# Altium schematic sheet M2_WIFI.SchDoc
size C; SheetNumber: 13; SheetTotal: 19
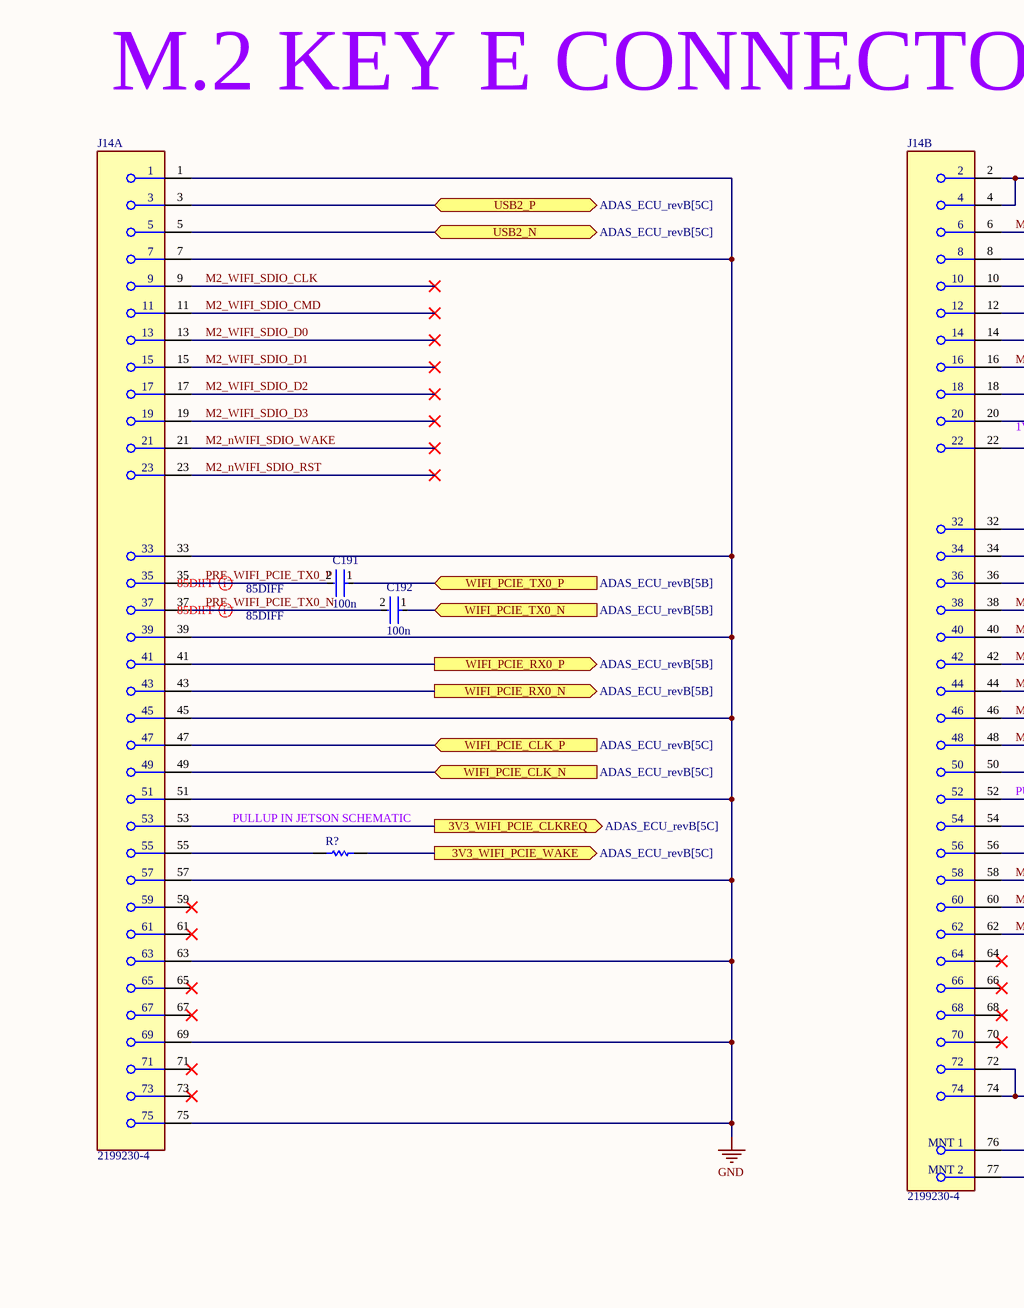
[diagram p0: M2_WIFI.SchDoc, left]
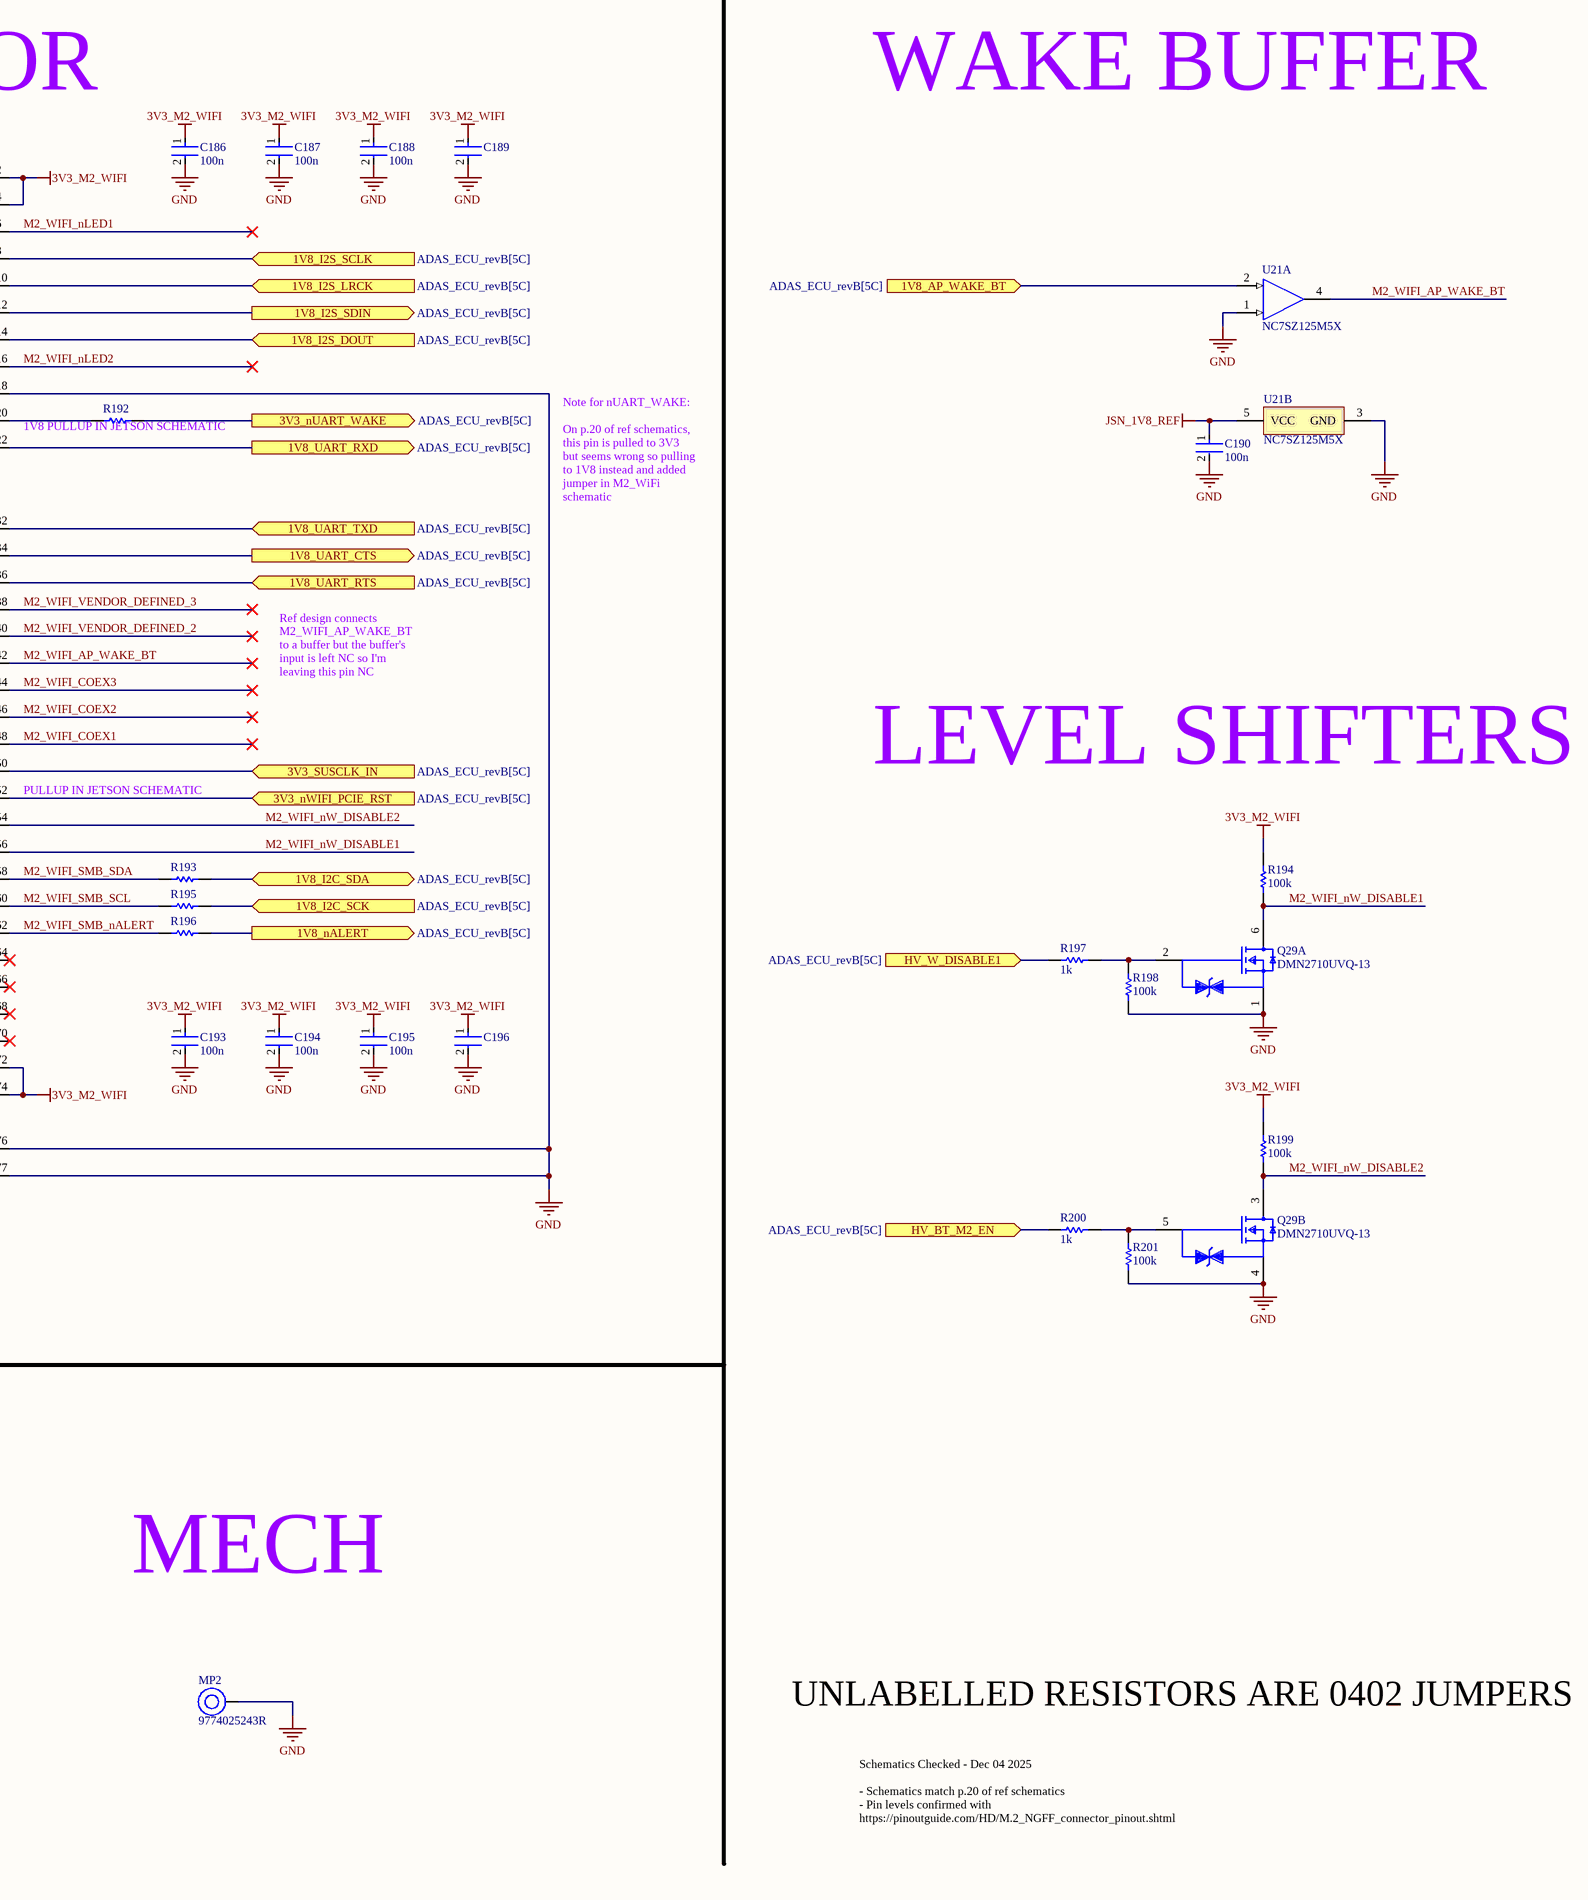
[diagram p1: M2_WIFI.SchDoc, right]

## Parts
C186  100n  [FP-0402-L_1_0_0_05-W_0_5-IPC_A]
C187  100n  [FP-0402-L_1_0_0_05-W_0_5-IPC_A]
C188  100n  [FP-0402-L_1_0_0_05-W_0_5-IPC_A]
C189  GRM188R60J106ME47D  [FP-GRM188-0_1-e0_2_0_55-IPC_A]  (value not drawn)
C190  100n  [FP-0402-L_1_0_0_05-W_0_5-IPC_A]
C191  100n  [FP-0402-L_1_0_0_05-W_0_5-IPC_A]
C192  100n  [FP-0402-L_1_0_0_05-W_0_5-IPC_A]
C193  100n  [FP-0402-L_1_0_0_05-W_0_5-IPC_A]
C194  100n  [FP-0402-L_1_0_0_05-W_0_5-IPC_A]
C195  100n  [FP-0402-L_1_0_0_05-W_0_5-IPC_A]
C196  GRM188R60J106ME47D  [FP-GRM188-0_1-e0_2_0_55-IPC_A]  (value not drawn)
J14  2199230-4  [FP-2199230-4-MFG]  (parts A,B of 2)
MP2  9774025243R  [9774025243]
Q29  DMN2710UVQ-13  [SOTFL50P162X60-6N]  (parts A,B of 2)
R192  0402 JUMPER  [RESC1005X40X25ML05T05]  (value not drawn)
R193  DNP  [RESC1005X40X25ML05T05]  (value not drawn)
R194  100k  [R0603B]
R195  DNP  [RESC1005X40X25ML05T05]  (value not drawn)
R196  DNP  [RESC1005X40X25ML05T05]  (value not drawn)
R197  1k  [R0603B]
R198  100k  [R0603B]
R199  100k  [R0603B]
R200  1k  [R0603B]
R201  100k  [R0603B]
R?  0402 JUMPER  [RESC1005X40X25ML05T05]  (value not drawn)
U21  NC7SZ125M5X  [FAIR-SOT23-5_V]  (parts A,B of 2)

## Ports
1V8_AP_WAKE_BT (in, see ADAS_ECU_revB[5C]), 1V8_I2C_SCK (in, see ADAS_ECU_revB[5C]), 1V8_I2C_SDA (bidir, see ADAS_ECU_revB[5C]), 1V8_I2S_DOUT (in, see ADAS_ECU_revB[5C]), 1V8_I2S_LRCK (in, see ADAS_ECU_revB[5C]), 1V8_I2S_SCLK (in, see ADAS_ECU_revB[5C]), 1V8_I2S_SDIN (out, see ADAS_ECU_revB[5C]), 1V8_nALERT (out, see ADAS_ECU_revB[5C]), 1V8_UART_CTS (out, see ADAS_ECU_revB[5C]), 1V8_UART_RTS (in, see ADAS_ECU_revB[5C]), 1V8_UART_RXD (out, see ADAS_ECU_revB[5C]), 1V8_UART_TXD (in, see ADAS_ECU_revB[5C]), 3V3_nUART_WAKE (out, see ADAS_ECU_revB[5C]), 3V3_nWIFI_PCIE_RST (in, see ADAS_ECU_revB[5C]), 3V3_SUSCLK_IN (in, see ADAS_ECU_revB[5C]), 3V3_WIFI_PCIE_CLKREQ (out, see ADAS_ECU_revB[5C]), 3V3_WIFI_PCIE_WAKE (out, see ADAS_ECU_revB[5C]), HV_BT_M2_EN (in, see ADAS_ECU_revB[5C]), HV_W_DISABLE1 (in, see ADAS_ECU_revB[5C]), USB2_N (bidir, see ADAS_ECU_revB[5C]), USB2_P (bidir, see ADAS_ECU_revB[5C]), WIFI_PCIE_CLK_N (in, see ADAS_ECU_revB[5C]), WIFI_PCIE_CLK_P (in, see ADAS_ECU_revB[5C]), WIFI_PCIE_RX0_N (out, see ADAS_ECU_revB[5B]), WIFI_PCIE_RX0_P (out, see ADAS_ECU_revB[5B]), WIFI_PCIE_TX0_N (in, see ADAS_ECU_revB[5B]), WIFI_PCIE_TX0_P (in, see ADAS_ECU_revB[5B])

## Nets
3V3_M2_WIFI: C186.1 C187.1 C188.1 C189.1 C193.1 C194.1 C195.1 C196.1 J14.2 J14.4 J14.72 J14.74 R194.2 R199.2
GND: C186.2 C187.2 C188.2 C189.2 C190.2 C193.2 C194.2 C195.2 C196.2 J14.1 J14.7 J14.18 J14.33 J14.39 J14.45 J14.51 J14.57 J14.63 J14.69 J14.75 J14.76(MNT_1) J14.77(MNT_2) MP2.1 Q29.1(Source1) Q29.4(Source2) R198.1 R201.1 U21.1(~{OE}) U21.3(GND)
JSN_1V8_REF: C190.1 U21.5(VCC)
1V8_AP_WAKE_BT: U21.2(A) ; port 1V8_AP_WAKE_BT
1V8_I2C_SCK: R195.2 ; port 1V8_I2C_SCK
1V8_I2C_SDA: R193.2 ; port 1V8_I2C_SDA
1V8_I2S_DOUT: J14.14 ; port 1V8_I2S_DOUT
1V8_I2S_LRCK: J14.10 ; port 1V8_I2S_LRCK
1V8_I2S_SCLK: J14.8 ; port 1V8_I2S_SCLK
1V8_I2S_SDIN: J14.12 ; port 1V8_I2S_SDIN
1V8_nALERT: R196.2 ; port 1V8_nALERT
1V8_UART_CTS: J14.34 ; port 1V8_UART_CTS
1V8_UART_RTS: J14.36 ; port 1V8_UART_RTS
1V8_UART_RXD: J14.22 ; port 1V8_UART_RXD
1V8_UART_TXD: J14.32 ; port 1V8_UART_TXD
3V3_nUART_WAKE: R192.2 ; port 3V3_nUART_WAKE
3V3_nWIFI_PCIE_RST: J14.52 ; port 3V3_nWIFI_PCIE_RST
3V3_SUSCLK_IN: J14.50 ; port 3V3_SUSCLK_IN
3V3_WIFI_PCIE_CLKREQ: J14.53 ; port 3V3_WIFI_PCIE_CLKREQ
3V3_WIFI_PCIE_WAKE: R?.2 ; port 3V3_WIFI_PCIE_WAKE
HV_BT_M2_EN: R200.2 ; port HV_BT_M2_EN
HV_W_DISABLE1: R197.2 ; port HV_W_DISABLE1
M2_nWIFI_SDIO_RST: J14.23
M2_nWIFI_SDIO_WAKE: J14.21
M2_WIFI_AP_WAKE_BT: J14.42 U21.4(Y)
M2_WIFI_COEX1: J14.48
M2_WIFI_COEX2: J14.46
M2_WIFI_COEX3: J14.44
M2_WIFI_nLED1: J14.6
M2_WIFI_nLED2: J14.16
M2_WIFI_nW_DISABLE1: J14.56 Q29.6(Drain1) R194.1
M2_WIFI_nW_DISABLE2: J14.54 Q29.3(Drain2) R199.1
M2_WIFI_SDIO_CLK: J14.9
M2_WIFI_SDIO_CMD: J14.11
M2_WIFI_SDIO_D0: J14.13
M2_WIFI_SDIO_D1: J14.15
M2_WIFI_SDIO_D2: J14.17
M2_WIFI_SDIO_D3: J14.19
M2_WIFI_SMB_nALERT: J14.62 R196.1
M2_WIFI_SMB_SCL: J14.60 R195.1
M2_WIFI_SMB_SDA: J14.58 R193.1
M2_WIFI_VENDOR_DEFINED_2: J14.40
M2_WIFI_VENDOR_DEFINED_3: J14.38
PRE_WIFI_PCIE_TX0_N: C192.2 J14.37
PRE_WIFI_PCIE_TX0_P: C191.2 J14.35
USB2_N: J14.5 ; port USB2_N
USB2_P: J14.3 ; port USB2_P
WIFI_PCIE_CLK_N: J14.49 ; port WIFI_PCIE_CLK_N
WIFI_PCIE_CLK_P: J14.47 ; port WIFI_PCIE_CLK_P
WIFI_PCIE_RX0_N: J14.43 ; port WIFI_PCIE_RX0_N
WIFI_PCIE_RX0_P: J14.41 ; port WIFI_PCIE_RX0_P
WIFI_PCIE_TX0_N: C192.1 ; port WIFI_PCIE_TX0_N
WIFI_PCIE_TX0_P: C191.1 ; port WIFI_PCIE_TX0_P
NetJ14_20: J14.20 R192.1
NetJ14_55: J14.55 R?.1
NetQ29_2: Q29.2(Gate1) R197.1 R198.2
NetQ29_5: Q29.5(Gate2) R200.1 R201.2

Not connected (* = marked no-connect by the designer): J14 59* 61* 64* 65* 66* 67* 68* 70* 71* 73*

## Layout directives
differential pair; differential pair class 85DIFF: PRE_WIFI_PCIE_TX0_N, PRE_WIFI_PCIE_TX0_P

## Notes on the sheet
- M.2 KEY E CONNECTOR
- WAKE BUFFER
- (near R192) 1V8 PULLUP IN JETSON SCHEMATIC
- Note for nUART_WAKE:
  On p.20 of ref schematics, this pin is pulled to 3V3 but seems wrong so pulling to 1V8 instead and added jumper in M2_WiFi schematic
- Ref design connects M2_WIFI_AP_WAKE_BT to a buffer but the buffer's input is left NC so I'm leaving this pin NC
- LEVEL SHIFTERS
- (near R?) PULLUP IN JETSON SCHEMATIC
- (near J14) PULLUP IN JETSON SCHEMATIC
- MECH
- UNLABELLED RESISTORS ARE 0402 JUMPERS
- Schematics Checked - Dec 04 2025
  - Schematics match p.20 of ref schematics
  - Pin levels confirmed with https://pinoutguide.com/HD/M.2_NGFF_connector_pinout.shtml

## Library data of the parts
C186-C188 C190-C195 = CMP-001-00058-1: LARGE PADS, 0402 CAP, CHANGE COMMENT TO MATCH REAL P/N; Capacitor Type: Ceramic; Min Operating Temperature: -55°C; Mounting Technology: Surface Mount; Pins: 2; Case/Package: 0402; RoHS Compliant: Yes; Max Operating Temperature: 85°C
C189 C196 = CMP-2006-02792-2: Chip Multilayer Ceramic Capacitors for General Purpose, 0603, 10uF, X5R, 15%, 20%, 6.3V; Packaging: Tape and Reel; Voltage Rating (DC): 6.3V; Width: 0.031inch; Termination: SMD/SMT; Dielectric: X5R; Package Quantity: 4000; Voltage Rating: 6.3V; Capacitance: 10uF; Case/Package: 0603; Min Operating Temperature: -55°C; Voltage: 6.3V; Length: 1.6mm; Thickness: 0.035inch; Lead Free: Lead Free; Depth: 0.8mm; Case Code (Imperial): 0603; Max Operating Temperature: 85°C; Material: Ceramic; Height: 0.8mm; Tolerance: 20%; Mount: Surface Mount; REACH SVHC: No SVHC; Radiation Hardening: No; Case Code (Metric): 1608
J14 = CMP-03365-000002-1: CONN FEMALE 67POS 0.020 GOLD; Manufacturer: TE Connectivity; Conn Orientation: Right Angle; Pitch: 0.5mm; Number Of Contacts: 67; Voltage Rating: 50V; Is Female: yes; Current Rating: 0.5A; Lead Free: Yes; Temperature Range Low: -40°C; Device Class L3: unset; Package: 0; Manufacturer Part Number: 2199230-4; RoHS: TRUE; Digikey Description: CONN FEMALE 67POS 0.020 GOLD; Category: Conn; Device Class L1: Connectors; Temperature Range High: +80°C; ComponentLink2Description: Datasheet; ComponentLink2URL: https://www.te.com/commerce/DocumentDelivery/DDEController?Action=showdoc&DocId=Customer+Drawing%7F2199230%7FB3%7Fpdf%7FEnglish%7FENG_CD_2199230_B3.pdf%7F2199230-4; Mouser Description: PCI Express / PCI Connectors .5PITCH 4.2H KEY E EMBOSS NGFF MINICARD; Automotive: No; Conn Gender: Female; Height: 4.2mm; Device Class L2: Card Edge Connectors; Contact Material: Gold,Nickel; Number Of Rows: 2; Octopart: https://octopart.com/2199230-4-te+connectivity-46436156; Temperature: -40°C to +80°C
MP2 = CMP-03913-59774857-1: 9774025243R Spacer Material: Steel, Tin-Plated Mounting: SMT Series: WA-SMST Thread D: M2; Outside Diameter: 4.3434mm; Threaded/Unthreaded: Threaded; Plating: Tin; REACH SVHC: Unknown; NexarPartId: 59774857; RoHS: Compliant; Material: Steel; Packaging: Tape and Reel; Max Operating Temperature: 150°C; Min Operating Temperature: -55°C; Length: 2.5mm; Height: 2.5mm
Q29 = CMP-013-00023-2: MOSFET Array, Dual N Channel, 20 V, 920 mA, 450 Milliohms, SOT-563, 6 Pins; Max Operating Temperature: 150°C; Min Operating Temperature: -55°C
R192 R193 R195 R196 R? = CMP-009-00118-2: READ THE NAME; Pins: 2; Component Type: Standard; Design Item ID: CMP-009-00206-2; Source: 0402jump.SchLib
R194 R197-R201 = CMP-009-00002-14: Resistor
U21 = CMP-2000-06816-1: TinyLogic UHS Buffer with Three-State Output, 1.65 to 5.5 V, -40 to 85 degC, 5-Pin SOT23, RoHS, Tape and Reel; Manufacturer: Fairchild Semiconductor; Input Signal Type: Single-Ended; Maximum Operating Supply Voltage: 5.5V; Number of Outputs per Chip: 1; Maximum Propagation Delay Time @ Maximum CL: 5.7@3.3V; Minimum Operating Supply Voltage: 1.65V; Maximum Quiescent Current: 2uA; Propagation Delay Test Condition: 50pF; Lead Finish: MatteTin; Number of Output Enables per Chip: 1Low; Maximum Low Level Output Current: 32mA; Output Type: 3-State; Package Version: 08/2015; Max Processing Temp: 260; Maximum High Level Output Current: -32mA; Tolerant I/Os: 5V; Bus Hold: No; Fabrication Technology: CMOS; Polarity: Non-Inverting; Typical Operating Supply Voltage: 1.8; Logic Function: Buffer/LineDriver; Manufacturer URL: https://www.fairchildsemi.com/; Mounting: SurfaceMount; Number of Channels per Chip: 1; Package Description: 5-Pin Small Outline Transistor, Body 2.9 x 1.6 mm, Pitch 0.95 mm; Package Reference: SOT23-5; Number of Elements per Chip: 1; Package URL: https://www.fairchildsemi.com/package-drawings/MA/MA05B.pdf; Datasheet URL: https://www.fairchildsemi.com/datasheets/NC/NC7SZ125.pdf; Datasheet Version: Rev. 1.0.5, 01/2014; Mounting Technology: SurfaceMount; Operating Temperature: -40to85C; Number of Inputs per Chip: 1